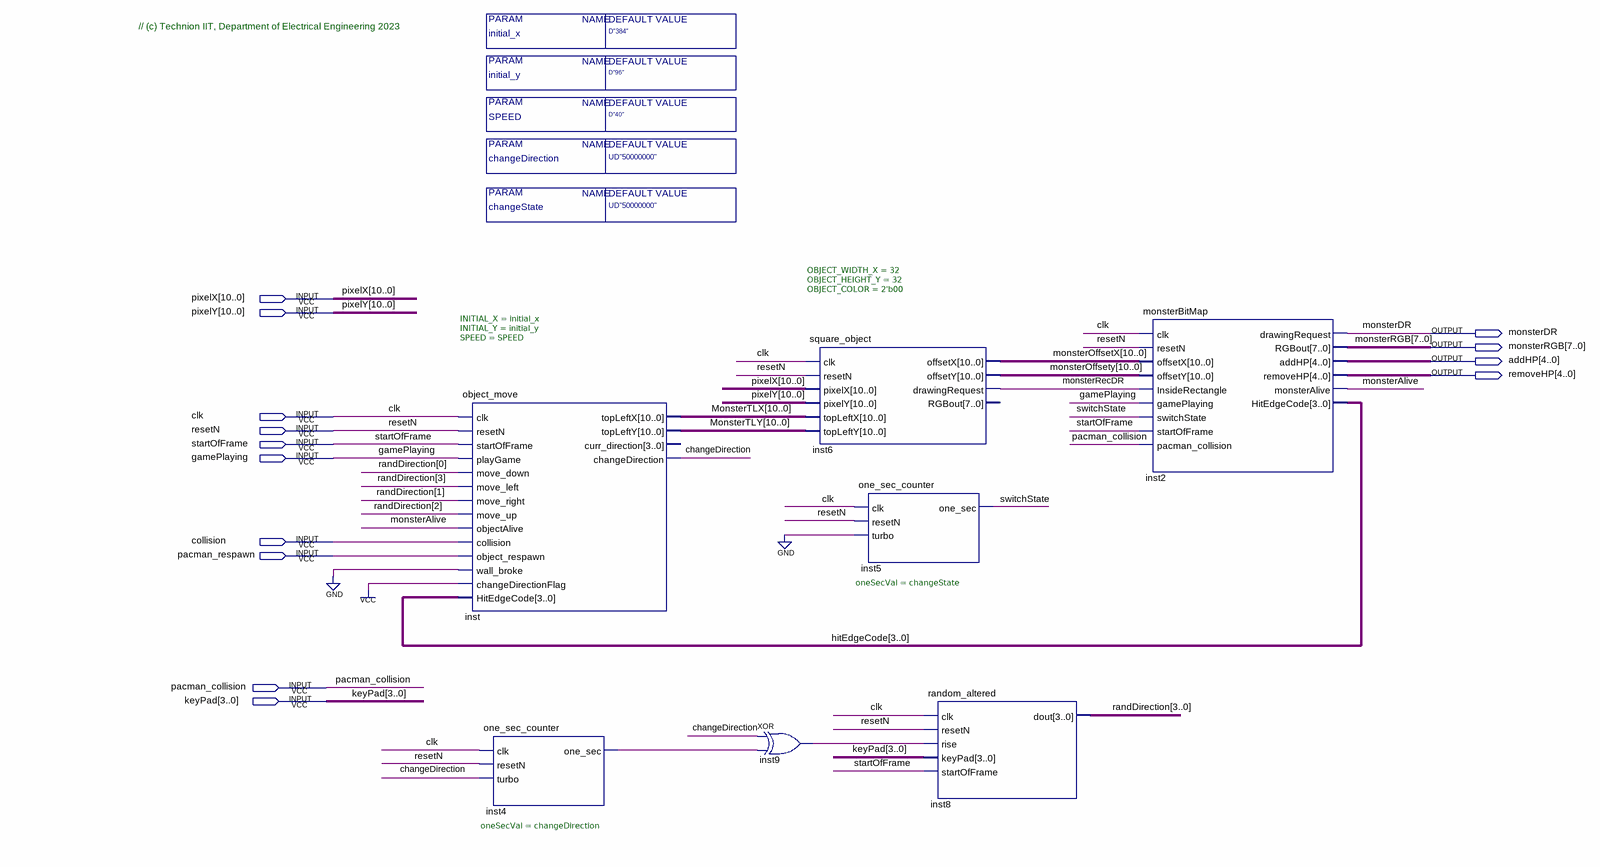
[diagram p0: schematic sheet]
// Quartus schematic Monster_Block_T.bdf as structural Verilog: 7 symbols, 14 pins
module Monster_Block_T #(parameter initial_x = "D\"384\"", parameter initial_y = "D\"96\"", parameter SPEED = "D\"40\"", parameter changeDirection = "UD\"50000000\"", parameter changeState = "UD\"50000000\"") (
  input  [10:0] pixelX,
  input  [10:0] pixelY,
  input  clk,
  input  resetN,
  input  startOfFrame,
  input  gamePlaying,
  input  collision,
  input  pacman_respawn,
  input  pacman_collision,
  input  [3:0] keyPad,
  output monsterDR,
  output [7:0] monsterRGB,
  output [4:0] addHP,
  output [4:0] removeHP
);

  wire changeDirection, inst4_one_sec, inst9_out, monsterAlive, monsterRecDR, switchState;
  wire [3:0] hitEdgeCode, randDirection;
  wire [10:0] monsterOffsetX, monsterOffsety, MonsterTLX, MonsterTLY;

  object_move #(.INITIAL_X(initial_x), .INITIAL_Y(initial_y), .SPEED(SPEED)) inst (
    .clk(clk), .resetN(resetN), .startOfFrame(startOfFrame), .playGame(gamePlaying),
    .move_down(randDirection[0]), .move_left(randDirection[3]), .move_right(randDirection[1]),
    .move_up(randDirection[2]), .objectAlive(monsterAlive), .collision(collision),
    .object_respawn(pacman_respawn), .wall_broke(1'b0), .changeDirectionFlag(1'b1),
    .HitEdgeCode(hitEdgeCode), .topLeftX(MonsterTLX), .topLeftY(MonsterTLY), .changeDirection(changeDirection));  // open: curr_direction
  one_sec_counter #(.oneSecVal(changeDirection)) inst4 (
    .clk(clk), .resetN(resetN), .turbo(changeDirection), .one_sec(inst4_one_sec));
  xor inst9 (inst9_out, changeDirection, inst4_one_sec);
  square_object #(.OBJECT_WIDTH_X(32), .OBJECT_HEIGHT_Y(32), .OBJECT_COLOR(2'b00)) inst6 (
    .clk(clk), .resetN(resetN), .pixelX(pixelX), .pixelY(pixelY), .topLeftX(MonsterTLX),
    .topLeftY(MonsterTLY), .offsetX(monsterOffsetX), .offsetY(monsterOffsety), .drawingRequest(monsterRecDR));  // open: RGBout
  one_sec_counter #(.oneSecVal(changeState)) inst5 (.clk(clk), .resetN(resetN), .turbo(1'b0), .one_sec(switchState));
  random_altered inst8 (
    .clk(clk), .resetN(resetN), .rise(inst9_out), .keyPad(keyPad), .startOfFrame(startOfFrame),
    .dout(randDirection));
  monsterBitMap inst2 (
    .clk(clk), .resetN(resetN), .offsetX(monsterOffsetX), .offsetY(monsterOffsety),
    .InsideRectangle(monsterRecDR), .gamePlaying(gamePlaying), .switchState(switchState),
    .startOfFrame(startOfFrame), .pacman_collision(pacman_collision), .drawingRequest(monsterDR),
    .RGBout(monsterRGB), .addHP(addHP), .removeHP(removeHP), .monsterAlive(monsterAlive),
    .HitEdgeCode(hitEdgeCode));

  // Notes on the sheet:
  //   // (c) Technion IIT, Department of Electrical Engineering 2023
endmodule
